# Altium schematic sheet Sheet1.SchDoc
size A4; Author: Samiru Nuwanaka; DrawnBy: Samiru Nuwanaka; Engineer: Samiru Nuwanaka; SheetNumber: 1; SheetTotal: 2
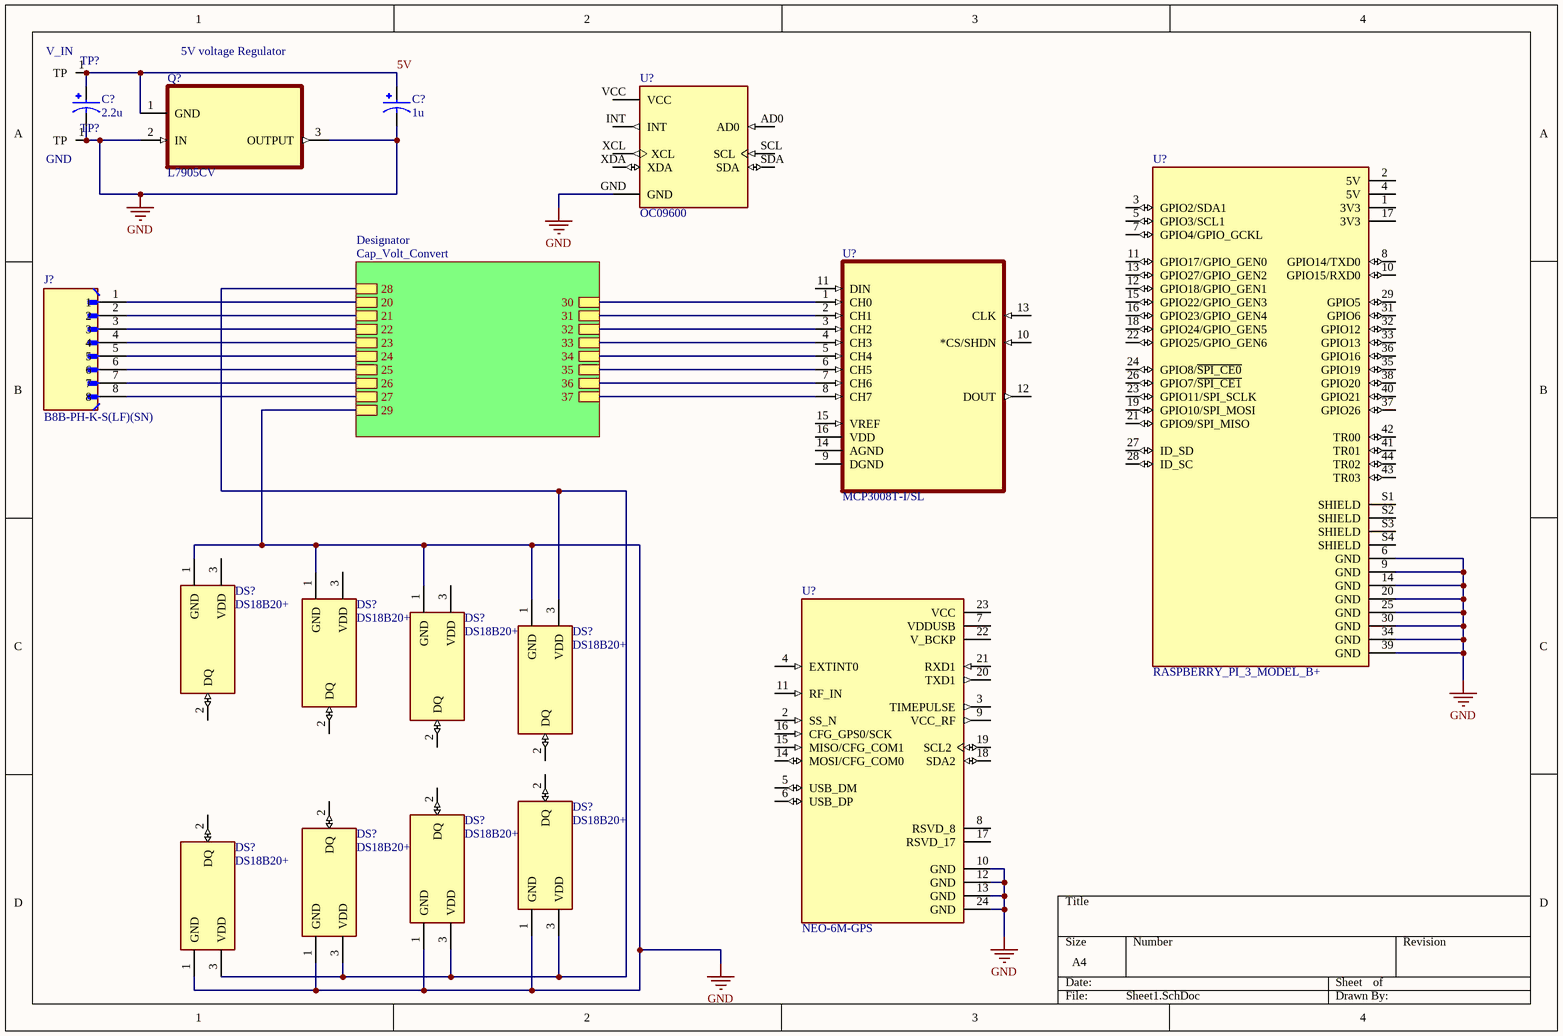
[diagram p0: Sheet1.SchDoc]

## Parts
(Parts that share a designator on the sheet are numbered #1, #2 ... from top to bottom, then left to right.)
C?#1  2.2u  [CAPPRD750W80D1600H2000]
C?#2  1u  [CAPPRD750W80D1600H2000]
DS?#1  DS18B20+  [IC_DS18B20+]
DS?#2  DS18B20+  [IC_DS18B20+]
DS?#3  DS18B20+  [IC_DS18B20+]
DS?#4  DS18B20+  [IC_DS18B20+]
DS?#5  DS18B20+  [IC_DS18B20+]
DS?#6  DS18B20+  [IC_DS18B20+]
DS?#7  DS18B20+  [IC_DS18B20+]
DS?#8  DS18B20+  [IC_DS18B20+]
J?  B8B-PH-K-S(LF)(SN)  [JST_B8B-PH-K-S(LF)(SN)]
Q?  L7905CV  [TO254P450X1020X1935-3P]
TP?#1  V_IN  [Testpoint]  (net tie, no BOM)
TP?#2  GND  [Testpoint]  (net tie, no BOM)
U?#1  OC09600  [MODULE_OC09600]
U?#2  RASPBERRY_PI_3_MODEL_B+  [MODULE_RASPBERRY_PI_3_MODEL_B+]
U?#3  MCP3008T-I/SL  [SOIC127P600X175-16N]
U?#4  NEO-6M-GPS  [XCVR_NEO-6M-GPS]

## Sub-sheets
Designator = Cap_Volt_Convert: 20, 21, 22, 23, 24, 25, 26, 27, 28, 29, 30, 31, 32, 33, 34, 35, 36, 37

## Nets
GND: C?#1.N C?#2.N DS?#1.1(GND) DS?#2.1(GND) DS?#3.1(GND) DS?#4.1(GND) DS?#5.1(GND) DS?#6.1(GND) DS?#7.1(GND) DS?#8.1(GND) Q?.2(IN) Q?.3(OUTPUT) TP?#2.1(TP) U?#1.GND U?#2.6(GND) U?#2.9(GND) U?#2.14(GND) U?#2.20(GND) U?#2.25(GND) U?#2.30(GND) U?#2.34(GND) U?#2.39(GND) U?#4.10(GND) U?#4.12(GND) U?#4.13(GND) U?#4.24(GND) ; sheet Designator/29
5V: C?#1.P C?#2.P Q?.1(GND) TP?#1.1(TP)
NetDS?#4_3: DS?#4.3(VDD) DS?#5.3(VDD) DS?#6.3(VDD) DS?#7.3(VDD) DS?#8.3(VDD) ; sheet Designator/28
NetJ?_1: J?.1 ; sheet Designator/20
NetJ?_2: J?.2 ; sheet Designator/21
NetJ?_3: J?.3 ; sheet Designator/22
NetJ?_4: J?.4 ; sheet Designator/23
NetJ?_5: J?.5 ; sheet Designator/24
NetJ?_6: J?.6 ; sheet Designator/25
NetJ?_7: J?.7 ; sheet Designator/26
NetJ?_8: J?.8 ; sheet Designator/27
NetU?#3_1: U?#3.1(CH0) ; sheet Designator/30
NetU?#3_2: U?#3.2(CH1) ; sheet Designator/31
NetU?#3_3: U?#3.3(CH2) ; sheet Designator/32
NetU?#3_4: U?#3.4(CH3) ; sheet Designator/33
NetU?#3_5: U?#3.5(CH4) ; sheet Designator/34
NetU?#3_6: U?#3.6(CH5) ; sheet Designator/35
NetU?#3_7: U?#3.7(CH6) ; sheet Designator/36
NetU?#3_8: U?#3.8(CH7) ; sheet Designator/37

Not connected (* = marked no-connect by the designer): DS?#1 2(DQ) 3(VDD); DS?#2 2(DQ) 3(VDD); DS?#3 2(DQ) 3(VDD); DS?#4 2(DQ); DS?#5 2(DQ); DS?#6 2(DQ); DS?#7 2(DQ); DS?#8 2(DQ); U?#1 AD0 INT SCL SDA VCC XCL XDA; U?#2 1(3V3) 2(5V) 3(GPIO2/SDA1) 4(5V) 5(GPIO3/SCL1) 7(GPIO4/GPIO_GCKL) 8(GPIO14/TXD0) 10(GPIO15/RXD0) 11(GPIO17/GPIO_GEN0) 12(GPIO18/GPIO_GEN1) 13(GPIO27/GPIO_GEN2) 15(GPIO22/GPIO_GEN3) 16(GPIO23/GPIO_GEN4) 17(3V3) 18(GPIO24/GPIO_GEN5) 19(GPIO10/SPI_MOSI) 21(GPIO9/SPI_MISO) 22(GPIO25/GPIO_GEN6) 23(GPIO11/SPI_SCLK) 24(GPIO8/~{SPI_CE0}) 26(GPIO7/~{SPI_CE1}) 27(ID_SD) 28(ID_SC) 29(GPIO5) 31(GPIO6) 32(GPIO12) 33(GPIO13) 35(GPIO19) 36(GPIO16) 37(GPIO26) 38(GPIO20) 40(GPIO21) 41(TR01) 42(TR00) 43(TR03) 44(TR02) S1(SHIELD) S2(SHIELD) S3(SHIELD) S4(SHIELD); U?#3 9(DGND) 10(*CS/SHDN) 11(DIN) 12(DOUT) 13(CLK) 14(AGND) 15(VREF) 16(VDD); U?#4 2(SS_N) 3(TIMEPULSE) 4(EXTINT0) 5(USB_DM) 6(USB_DP) 7(VDDUSB) 8(RSVD_8) 9(VCC_RF) 11(RF_IN) 14(MOSI/CFG_COM0) 15(MISO/CFG_COM1) 16(CFG_GPS0/SCK) 17(RSVD_17) 18(SDA2) 19(SCL2) 20(TXD1) 21(RXD1) 22(V_BCKP) 23(VCC)

## Notes on the sheet
- 5V voltage Regulator

## Library data of the parts
C?#1 C?#2 = EEUFS1J681S: CAP ALUM 680UF 20% 63V THRU HOLE; MP: EEU-FS1J681S; MF: Panasonic Electronic Components; Package: RADIAL-2 Panasonic; Availability: In Stock; SnapEDA_Link: https://www.snapeda.com/parts/EEU-FS1J681S/Panasonic/view-part/5562022/?ref=snap; Price: None; Check_prices: https://www.snapeda.com/parts/EEU-FS1J681S/Panasonic/view-part/5562022/?ref=eda; Value: *
DS?#1-DS?#8 = DS18B20+: Programmable Resolution 1-Wire Digital Thermometer; MF: Analog Devices; SnapEDA_Link: https://www.snapeda.com/parts/DS18B20+/Analog+Devices/view-part/?ref=snap; Package: TO-226-3 Maxim; Value: *; MP: DS18B20+; Check_prices: https://www.snapeda.com/parts/DS18B20+/Analog+Devices/view-part/?ref=eda
J? = B8B-PH-K-S(LF)(SN): Connector Header Through Hole 8 position 0.079 (2.00mm); MF: JST Sales; SnapEDA_Link: https://www.snapeda.com/parts/B8B-PH-K-S(LF)(SN)/JST+Sales+America+Inc./view-part/?ref=snap; Package: None; Value: *; MP: B8B-PH-K-S(LF)(SN); Check_prices: https://www.snapeda.com/parts/B8B-PH-K-S(LF)(SN)/JST+Sales+America+Inc./view-part/?ref=eda
Q? = L7905CV: Linear Voltage Regulator IC Negative Fixed 1 Output 1.5A TO-220; MF: STMicroelectronics; SnapEDA_Link: https://www.snapeda.com/parts/L7905CV/STMicroelectronics/view-part/?ref=snap; Package: TO-220-3 STMicroelectronics; Value: *; MP: L7905CV; Check_prices: https://www.snapeda.com/parts/L7905CV/STMicroelectronics/view-part/?ref=eda
TP?#1 TP?#2 = Testpoint
U?#1 = OC09600: GY-521 6 DOF MPU-6050 Module 3 Axis Accelerometer Gyroscope Module for Arduino; MF: YKS; SnapEDA_Link: https://www.snapeda.com/parts/OC09600/YKS/view-part/?ref=snap; Package: None; Value: *; MP: OC09600; Check_prices: https://www.snapeda.com/parts/OC09600/YKS/view-part/?ref=eda
U?#2 = RASPBERRY_PI_3_MODEL_B+: Case Plastic, ABS Black Hand Held, Split Sides 3.520 L x 2.740 W (89.41mm x 69.60mm) X 0.980 (24.89mm); MF: Raspberry Pi; MP: RASPBERRY PI 3 MODEL B+; Purchase-URL: https://pricing.snapeda.com/search/part/RASPBERRY PI 3 MODEL B+/?ref=eda; Check_prices: https://www.snapeda.com/parts/RASPBERRY%20PI%203%20MODEL%20B+/Raspberry+Pi/view-part/?ref=eda; SnapEDA_Link: https://www.snapeda.com/parts/RASPBERRY%20PI%203%20MODEL%20B+/Raspberry+Pi/view-part/?ref=snap; Price: None; Availability: In Stock; Package: Raspberry Pi; Value: *
U?#3 = MCP3008T-I/SL: 10-bit ADC, SPI, 8-channel16 SOIC .150in T/R | Microchip Technology Inc. MCP3008T-I/SL; SnapEDA_Link: https://www.snapeda.com/parts/MCP3008T-I/SL/Microchip/view-part/?ref=snap; Package: SOIC-16 Microchip; Value: *; MF: Microchip Technology; MP: MCP3008T-I/SL; Check_prices: https://www.snapeda.com/parts/MCP3008T-I/SL/Microchip/view-part/?ref=eda
U?#4 = NEO-6M-GPS: GPS Development Tools SparkFun GNSS-RTK Dead Reckoning Breakout - ZED-F9K (Qwiic); MF: u-blox; SnapEDA_Link: https://www.snapeda.com/parts/NEO-6M-GPS/u-blox/view-part/?ref=snap; MP: NEO-6M-GPS; Availability: Not in stock; Price: None; Check_prices: https://www.snapeda.com/parts/NEO-6M-GPS/u-blox/view-part/?ref=eda; Value: *; Package: None